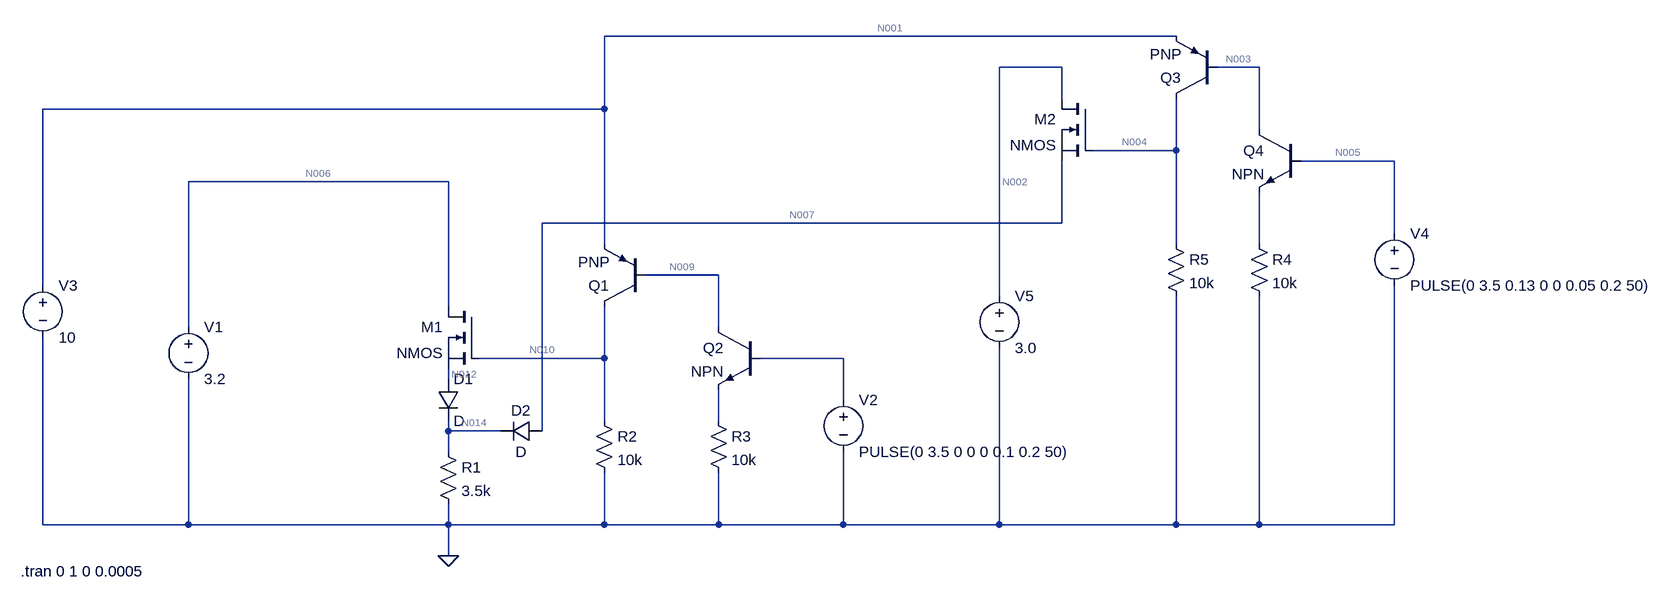
[diagram p0: schematic VoltSampleCell1Sim.asc]
VoltSampleCell1Sim.asc, the LTspice schematic file:
Version 4
SHEET 1 2400 680
WIRE 1648 -320 768 -320
WIRE 1472 -272 1376 -272
WIRE 1776 -272 1712 -272
WIRE 1472 -224 1472 -272
WIRE 768 -208 768 -320
WIRE 768 -208 -96 -208
WIRE 1776 -176 1776 -272
WIRE 1648 -144 1648 -224
WIRE 1648 -144 1520 -144
WIRE 1984 -128 1840 -128
WIRE 528 -96 128 -96
WIRE 1472 -32 1472 -128
WIRE 1472 -32 672 -32
WIRE 1984 -16 1984 -128
WIRE 768 0 768 -208
WIRE 1648 0 1648 -144
WIRE 1776 0 1776 -80
WIRE 944 48 832 48
WIRE -96 64 -96 -208
WIRE 1376 80 1376 -272
WIRE 528 96 528 -96
WIRE 128 128 128 -96
WIRE 944 128 944 48
WIRE 768 176 768 96
WIRE 768 176 576 176
WIRE 1136 176 1008 176
WIRE 528 208 528 192
WIRE 1136 240 1136 176
WIRE 768 272 768 176
WIRE 944 272 944 224
WIRE 528 288 528 272
WIRE 608 288 528 288
WIRE 672 288 672 -32
WIRE 528 320 528 288
WIRE -96 432 -96 144
WIRE 128 432 128 208
WIRE 128 432 -96 432
WIRE 528 432 528 400
WIRE 528 432 128 432
WIRE 768 432 768 352
WIRE 768 432 528 432
WIRE 944 432 944 352
WIRE 944 432 768 432
WIRE 1136 432 1136 320
WIRE 1136 432 944 432
WIRE 1376 432 1376 160
WIRE 1376 432 1136 432
WIRE 1648 432 1648 80
WIRE 1648 432 1376 432
WIRE 1776 432 1776 80
WIRE 1776 432 1648 432
WIRE 1984 432 1984 64
WIRE 1984 432 1776 432
WIRE 528 480 528 432
FLAG 528 480 0
SYMBOL voltage 128 112 R0
WINDOW 123 0 0 Left 0
WINDOW 39 0 0 Left 0
SYMATTR InstName V1
SYMATTR Value 3.2
SYMBOL nmos 576 96 M0
SYMATTR InstName M1
SYMBOL res 512 304 R0
SYMATTR InstName R1
SYMATTR Value 3.5k
SYMBOL pnp 832 96 R180
SYMATTR InstName Q1
SYMBOL npn 1008 128 M0
SYMATTR InstName Q2
SYMBOL res 752 256 R0
SYMATTR InstName R2
SYMATTR Value 10k
SYMBOL res 928 256 R0
SYMATTR InstName R3
SYMATTR Value 10k
SYMBOL voltage 1136 224 R0
WINDOW 123 0 0 Left 0
WINDOW 39 0 0 Left 0
SYMATTR InstName V2
SYMATTR Value PULSE(0 3.5 0 0 0 0.1 0.2 50)
SYMBOL voltage -96 48 R0
WINDOW 123 0 0 Left 0
WINDOW 39 0 0 Left 0
SYMATTR InstName V3
SYMATTR Value 10
SYMBOL pnp 1712 -224 R180
SYMATTR InstName Q3
SYMBOL npn 1840 -176 M0
SYMATTR InstName Q4
SYMBOL nmos 1520 -224 M0
SYMATTR InstName M2
SYMBOL voltage 1984 -32 R0
WINDOW 123 0 0 Left 0
WINDOW 39 0 0 Left 0
SYMATTR InstName V4
SYMATTR Value PULSE(0 3.5 0.13 0 0 0.05 0.2 50)
SYMBOL res 1760 -16 R0
SYMATTR InstName R4
SYMATTR Value 10k
SYMBOL res 1632 -16 R0
SYMATTR InstName R5
SYMATTR Value 10k
SYMBOL diode 512 208 R0
SYMATTR InstName D1
SYMBOL diode 672 272 R90
WINDOW 0 0 32 VBottom 2
WINDOW 3 32 32 VTop 2
SYMATTR InstName D2
SYMBOL voltage 1376 64 R0
WINDOW 123 0 0 Left 0
WINDOW 39 0 0 Left 0
SYMATTR InstName V5
SYMATTR Value 3.0
TEXT -130 504 Left 2 !.tran 0 1 0 0.0005

The netlist it stands for:
* VoltSampleCell1Sim.asc
V1 N006 0 3.2
M1 N006 N010 N012 N012 NMOS
R1 N014 0 3.5k
Q1 N010 N009 N001 0 PNP
Q2 N009 N011 N013 0 NPN
R2 N010 0 10k
R3 N013 0 10k
V2 N011 0 PULSE(0 3.5 0 0 0 0.1 0.2 50)
V3 N001 0 10
Q3 N004 N003 N001 0 PNP
Q4 N003 N005 N008 0 NPN
M2 N002 N004 N007 N007 NMOS
V4 N005 0 PULSE(0 3.5 0.13 0 0 0.05 0.2 50)
R4 N008 0 10k
R5 N004 0 10k
D1 N012 N014 D
D2 N007 N014 D
V5 N002 0 3.0
.model D D
.lib standard.dio
.model NPN NPN
.model PNP PNP
.lib standard.bjt
.model NMOS NMOS
.model PMOS PMOS
.lib standard.mos
.tran 0 1 0 0.0005
.backanno
.end

* Results of the author's LTspice run, read from the files saved beside the schematic
* Operating Point, zero values left out:
*   V(n006) = 3.2 V
*   V(n010) = 18.8 µV
*   V(n012) = 165.1 mV
*   V(n014) = 41.17 nV
*   V(n009) = 9.567 V
*   V(n001) = 10 V
*   V(n004) = 18.8 µV
*   V(n003) = 9.567 V
*   V(n002) = 3 V
*   V(n007) = 163.3 mV
*   Ic(Q4) = 9.567 pA
*   Ib(Q4) = -9.567 pA
*   Ic(Q2) = 9.567 pA
*   Ib(Q2) = -9.567 pA
*   Ic(Q3) = -1.88 nA
*   Ib(Q3) = -9.572 pA
*   Ie(Q3) = 1.89 nA
*   Ic(Q1) = -1.88 nA
*   Ib(Q1) = -9.572 pA
*   Ie(Q1) = 1.89 nA
*   Id(M2) = 5.683 pA
*   Ib(M2) = -2.847 pA
*   Is(M2) = -2.837 pA
*   Id(M1) = 6.08 pA
*   Ib(M1) = -3.045 pA
*   Is(M1) = -3.035 pA
*   I(D2) = 5.683 pA
*   I(D1) = 6.08 pA
*   I(R5) = 1.88 nA
*   I(R2) = 1.88 nA
*   I(R1) = 11.76 pA
*   I(V5) = -5.683 pA
*   I(V4) = 9.567 pA
*   I(V3) = -3.778 nA
*   I(V2) = 9.567 pA
*   I(V1) = -6.08 pA
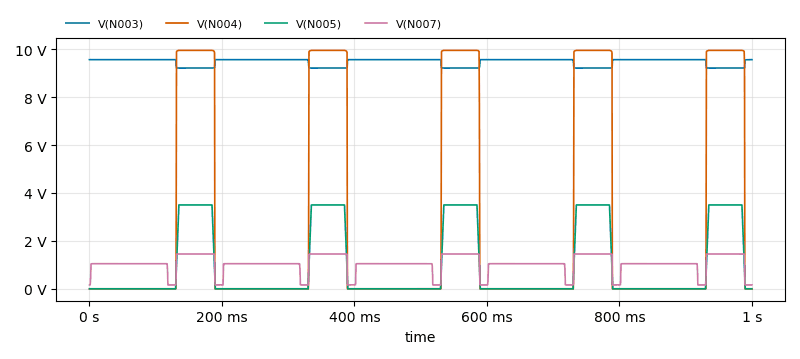
[diagram p1: Transient Analysis of VoltSampleCell1Sim.asc, plotted from the saved traces]
* Transient Analysis, 1 run:
*   V(N003): min 9.215 V, max 9.567 V, average 9.464 V, rms 9.465 V, last 9.567 V
*   V(N004): min 18.77 µV, max 9.954 V, average 2.883 V, rms 5.349 V, last 18.8 µV
*   V(N005): min 0 V, max 3.5 V, average 962.5 mV, rms 1.809 V, last 0 V
*   V(N007): min 163.3 mV, max 1.454 V, average 1.051 V, rms 1.119 V, last 163.3 mV